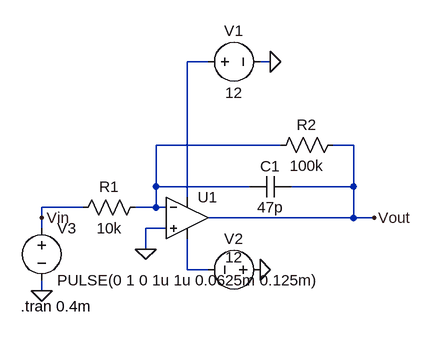
[diagram p0: schematic integrator.asc]
integrator.asc, the LTspice schematic file:
Version 4
SHEET 1 880 680
WIRE 240 -80 208 -80
WIRE 336 -80 320 -80
WIRE 352 48 160 48
WIRE 464 48 432 48
WIRE 160 112 160 48
WIRE 304 112 160 112
WIRE 464 112 464 48
WIRE 464 112 368 112
WIRE 208 128 208 -80
WIRE 48 144 -16 144
WIRE 160 144 160 112
WIRE 160 144 128 144
WIRE 176 144 160 144
WIRE -16 160 -16 144
WIRE 464 160 464 112
WIRE 464 160 240 160
WIRE 496 160 464 160
WIRE -16 176 -16 160
WIRE 176 176 144 176
WIRE 144 208 144 176
WIRE 208 240 208 192
WIRE 240 240 208 240
WIRE -16 272 -16 256
FLAG 320 240 0
FLAG 144 208 0
FLAG 336 -80 0
FLAG -16 272 0
FLAG 496 160 Vout
FLAG -16 160 Vin
SYMBOL voltage 336 240 R90
WINDOW 0 -32 56 VBottom 2
WINDOW 3 -4 56 VBottom 2
WINDOW 123 0 0 Left 0
WINDOW 39 0 0 Left 0
SYMATTR InstName V2
SYMATTR Value 12
SYMBOL res 144 128 R90
WINDOW 0 0 56 VBottom 2
WINDOW 3 32 56 VTop 2
SYMATTR InstName R1
SYMATTR Value 10k
SYMBOL OpAmps\\UniversalOpamp 208 160 R0
SYMATTR InstName U1
SYMBOL voltage 224 -80 R270
WINDOW 0 32 56 VTop 2
WINDOW 3 -32 56 VBottom 2
WINDOW 123 0 0 Left 0
WINDOW 39 0 0 Left 0
SYMATTR InstName V1
SYMATTR Value 12
SYMBOL voltage -16 160 R0
WINDOW 123 0 0 Left 0
WINDOW 39 0 0 Left 0
SYMATTR InstName V3
SYMATTR Value PULSE(0 1 0 1u 1u 0.0625m 0.125m)
SYMBOL cap 368 96 R90
WINDOW 0 0 32 VBottom 2
WINDOW 3 32 32 VTop 2
SYMATTR InstName C1
SYMATTR Value 47p
SYMBOL res 448 32 R90
WINDOW 0 0 56 VBottom 2
WINDOW 3 32 56 VTop 2
SYMATTR InstName R2
SYMATTR Value 100k
TEXT -48 296 Left 2 !.tran 0.4m

The netlist it stands for:
* integrator.asc
V2 0 N003 12
R1 N002 Vin 10k
XU1 0 N002 N001 N003 Vout level1 Avol=1Meg GBW=10Meg Vos=0 En=0 Enk=0 In=0 Ink=0 Rin=500Meg  ; pins In+ In- V+ V- OUT
V1 N001 0 12
V3 Vin 0 PULSE(0 1 0 1u 1u 0.0625m 0.125m)
C1 Vout N002 47p
R2 Vout N002 100k
.tran 0.4m
.lib UniversalOpAmp1.lib
.backanno
.end